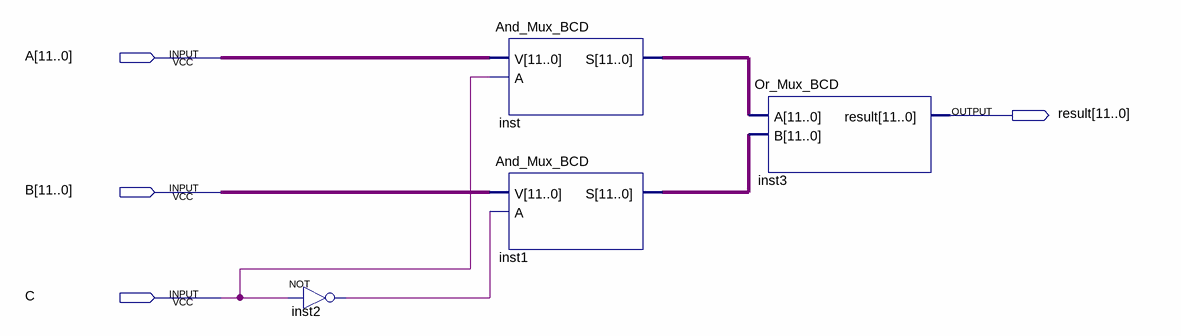
[diagram p0: schematic sheet]
// Quartus schematic Mux_BCD.bdf as structural Verilog: 4 symbols, 4 pins
module Mux_BCD (
  input  [11:0] A,
  input  [11:0] B,
  input  C,
  output [11:0] result
);

  wire inst2_out;
  wire [11:0] inst1_s, inst_s;

  not inst2 (inst2_out, C);
  And_Mux_BCD inst (.V(A), .A(C), .S(inst_s));
  And_Mux_BCD inst1 (.V(B), .A(inst2_out), .S(inst1_s));
  Or_Mux_BCD inst3 (.A(inst_s), .B(inst1_s), .result(result));
endmodule
